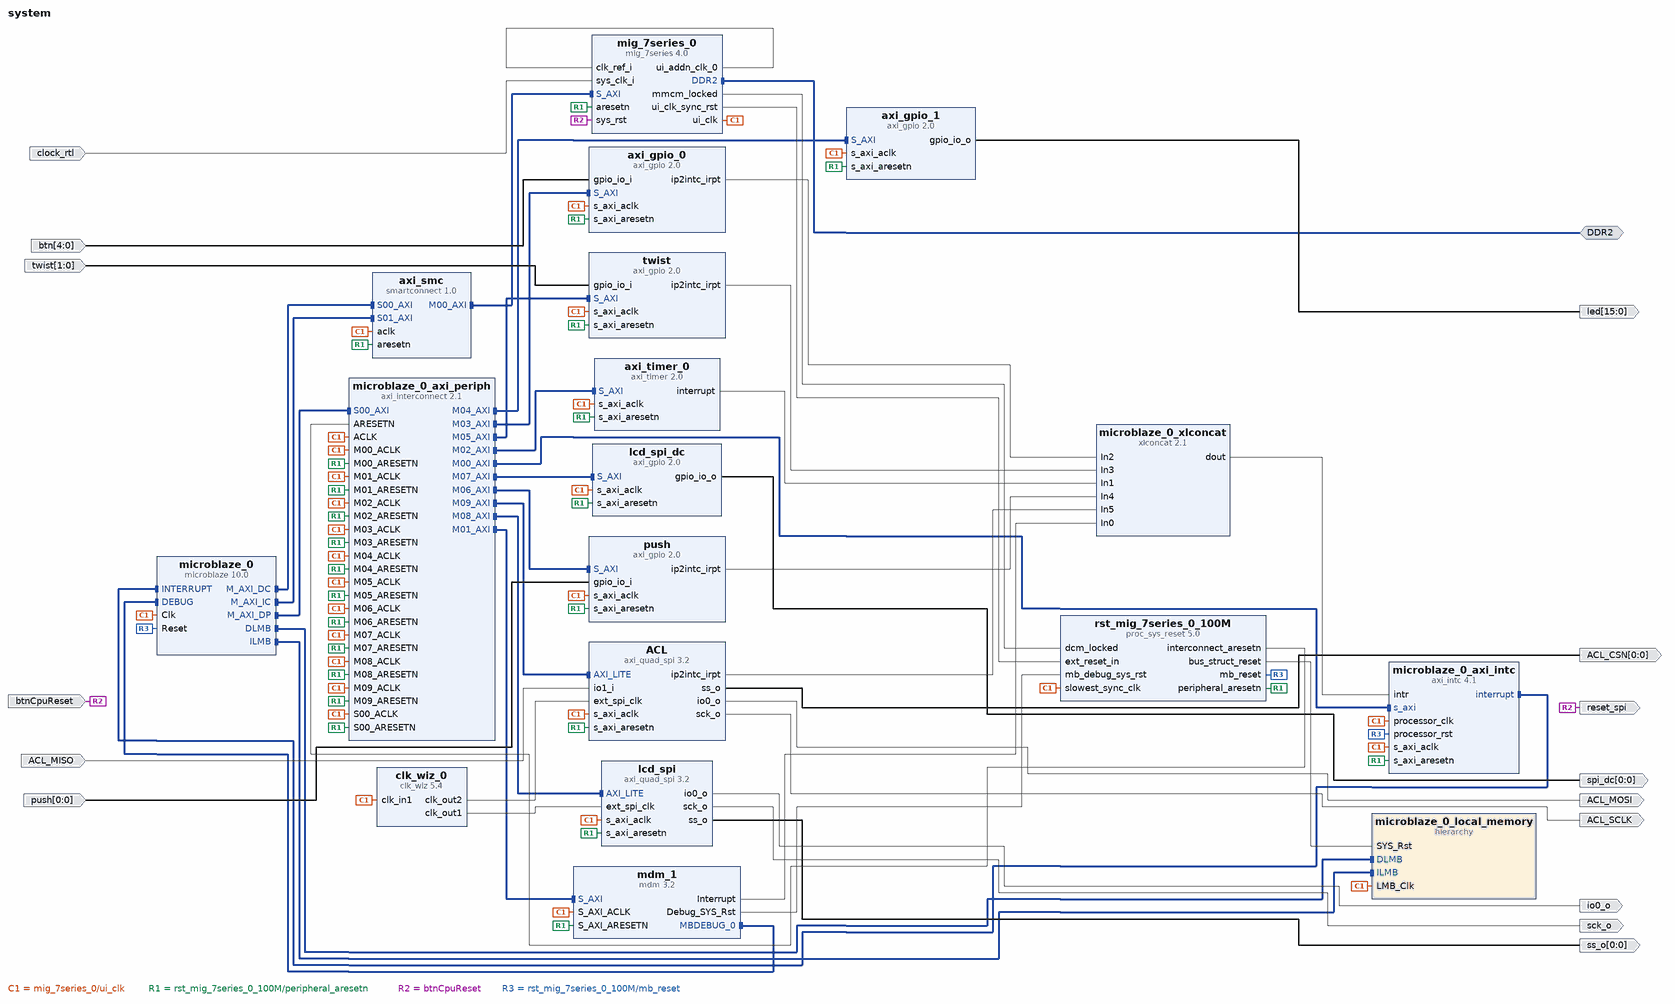
[diagram p0: block diagram of the top level]
# Vivado block design system, xc7a100tcsg324-1, Vivado 2017.2
create_bd_design system

create_bd_intf_port -mode Master -vlnv xilinx.com:interface:ddrx_rtl:1.0 DDR2
create_bd_port -dir I -type clk clock_rtl
set_property -dict {CONFIG.CLK_DOMAIN clock_rtl} [get_bd_ports clock_rtl]
create_bd_port -dir I -type rst btnCpuReset
create_bd_port -dir O reset_spi
create_bd_port -dir I -from 4 -to 0 btn
create_bd_port -dir O -from 15 -to 0 led
create_bd_port -dir I -from 1 -to 0 twist
create_bd_port -dir I -from 0 -to 0 push
create_bd_port -dir O -from 0 -to 0 spi_dc
create_bd_port -dir O io0_o
create_bd_port -dir O sck_o
create_bd_port -dir O -from 0 -to 0 ss_o
create_bd_port -dir I ACL_MISO
create_bd_port -dir O ACL_SCLK
create_bd_port -dir O -from 0 -to 0 ACL_CSN
create_bd_port -dir O ACL_MOSI

create_bd_cell -type ip -vlnv xilinx.com:ip:microblaze:10.0 microblaze_0
set_property -dict [list \
  CONFIG.C_D_AXI 1 \
  CONFIG.C_D_LMB 1 \
  CONFIG.C_I_LMB 1 \
  CONFIG.C_USE_MSR_INSTR 1 \
  CONFIG.C_USE_PCMP_INSTR 1 \
  CONFIG.C_USE_BARREL 1 \
  CONFIG.C_USE_DIV 1 \
  CONFIG.C_USE_HW_MUL 2 \
  CONFIG.C_USE_FPU 1 \
  CONFIG.C_DEBUG_ENABLED 1 \
  CONFIG.C_USE_ICACHE 1 \
  CONFIG.C_CACHE_BYTE_SIZE 65536 \
  CONFIG.C_USE_DCACHE 1 \
  CONFIG.C_DCACHE_BYTE_SIZE 65536 \
  CONFIG.C_USE_BRANCH_TARGET_CACHE 1 \
  CONFIG.C_BRANCH_TARGET_CACHE_SIZE 5 \
] [get_bd_cells microblaze_0]
create_bd_cell -type hier microblaze_0_local_memory
create_bd_cell -type ip -vlnv xilinx.com:ip:axi_interconnect:2.1 microblaze_0_axi_periph
set_property -dict {CONFIG.NUM_MI 10} [get_bd_cells microblaze_0_axi_periph]
create_bd_cell -type ip -vlnv xilinx.com:ip:axi_intc:4.1 microblaze_0_axi_intc
set_property -dict {CONFIG.C_HAS_FAST 1} [get_bd_cells microblaze_0_axi_intc]
create_bd_cell -type ip -vlnv xilinx.com:ip:xlconcat:2.1 microblaze_0_xlconcat
set_property -dict {CONFIG.NUM_PORTS 6} [get_bd_cells microblaze_0_xlconcat]
create_bd_cell -type ip -vlnv xilinx.com:ip:mdm:3.2 mdm_1
set_property -dict {CONFIG.C_USE_UART 1} [get_bd_cells mdm_1]
create_bd_cell -type ip -vlnv xilinx.com:ip:mig_7series:4.0 mig_7series_0
set_property -dict [list \
  CONFIG.XML_INPUT_FILE mig_b.prj \
  CONFIG.RESET_BOARD_INTERFACE Custom \
  CONFIG.MIG_DONT_TOUCH_PARAM Custom \
  CONFIG.BOARD_MIG_PARAM Custom \
] [get_bd_cells mig_7series_0]
create_bd_cell -type ip -vlnv xilinx.com:ip:smartconnect:1.0 axi_smc
set_property -dict {CONFIG.NUM_SI 2} [get_bd_cells axi_smc]
create_bd_cell -type ip -vlnv xilinx.com:ip:proc_sys_reset:5.0 rst_mig_7series_0_100M
create_bd_cell -type ip -vlnv xilinx.com:ip:axi_timer:2.0 axi_timer_0
create_bd_cell -type ip -vlnv xilinx.com:ip:axi_gpio:2.0 axi_gpio_0
set_property -dict {CONFIG.C_GPIO_WIDTH 5 CONFIG.C_ALL_INPUTS 1 CONFIG.C_INTERRUPT_PRESENT 1} [get_bd_cells axi_gpio_0]
create_bd_cell -type ip -vlnv xilinx.com:ip:axi_gpio:2.0 axi_gpio_1
set_property -dict {CONFIG.C_GPIO_WIDTH 16 CONFIG.C_ALL_OUTPUTS 1} [get_bd_cells axi_gpio_1]
create_bd_cell -type ip -vlnv xilinx.com:ip:axi_gpio:2.0 twist
set_property -dict {CONFIG.C_GPIO_WIDTH 2 CONFIG.C_ALL_INPUTS 1 CONFIG.C_INTERRUPT_PRESENT 1} [get_bd_cells twist]
create_bd_cell -type ip -vlnv xilinx.com:ip:axi_gpio:2.0 push
set_property -dict {CONFIG.C_GPIO_WIDTH 1 CONFIG.C_ALL_INPUTS 1 CONFIG.C_INTERRUPT_PRESENT 1} [get_bd_cells push]
create_bd_cell -type ip -vlnv xilinx.com:ip:axi_gpio:2.0 lcd_spi_dc
set_property -dict {CONFIG.C_GPIO_WIDTH 1 CONFIG.C_ALL_OUTPUTS 1} [get_bd_cells lcd_spi_dc]
create_bd_cell -type ip -vlnv xilinx.com:ip:clk_wiz:5.4 clk_wiz_0
set_property -dict [list \
  CONFIG.CLKOUT2_USED true \
  CONFIG.NUM_OUT_CLKS 2 \
  CONFIG.CLKOUT1_REQUESTED_OUT_FREQ 20.000 \
  CONFIG.CLKOUT2_REQUESTED_OUT_FREQ 10.000 \
  CONFIG.USE_LOCKED false \
  CONFIG.USE_RESET false \
  CONFIG.MMCM_DIVCLK_DIVIDE 1 \
  CONFIG.MMCM_CLKFBOUT_MULT_F 10.000 \
  CONFIG.MMCM_CLKOUT0_DIVIDE_F 50.000 \
  CONFIG.MMCM_CLKOUT1_DIVIDE 100 \
  CONFIG.CLKOUT1_JITTER 183.243 \
  CONFIG.CLKOUT1_PHASE_ERROR 98.575 \
  CONFIG.CLKOUT2_JITTER 209.588 \
  CONFIG.CLKOUT2_PHASE_ERROR 98.575 \
] [get_bd_cells clk_wiz_0]
create_bd_cell -type ip -vlnv xilinx.com:ip:axi_quad_spi:3.2 lcd_spi
set_property -dict {CONFIG.C_USE_STARTUP 0 CONFIG.C_SCK_RATIO 2 CONFIG.C_FIFO_DEPTH 256} [get_bd_cells lcd_spi]
create_bd_cell -type ip -vlnv xilinx.com:ip:axi_quad_spi:3.2 ACL
set_property -dict [list \
  CONFIG.C_USE_STARTUP 0 \
  CONFIG.C_SCK_RATIO 2 \
  CONFIG.C_FIFO_DEPTH 256 \
  CONFIG.C_XIP_MODE 0 \
  CONFIG.C_TYPE_OF_AXI4_INTERFACE 0 \
] [get_bd_cells ACL]

# ---- hierarchy /microblaze_0_local_memory ----
current_bd_instance /microblaze_0_local_memory
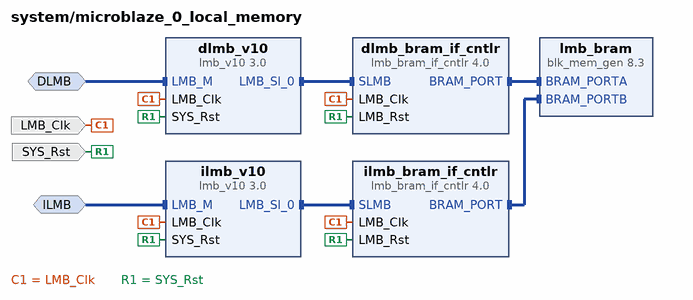
[diagram p1: block diagram inside /microblaze_0_local_memory]
create_bd_intf_pin -mode MirroredMaster -vlnv xilinx.com:interface:lmb_rtl:1.0 DLMB
create_bd_intf_pin -mode MirroredMaster -vlnv xilinx.com:interface:lmb_rtl:1.0 ILMB
create_bd_pin -dir I -type clk LMB_Clk
create_bd_pin -dir I SYS_Rst

create_bd_cell -type ip -vlnv xilinx.com:ip:lmb_v10:3.0 dlmb_v10
create_bd_cell -type ip -vlnv xilinx.com:ip:lmb_v10:3.0 ilmb_v10
create_bd_cell -type ip -vlnv xilinx.com:ip:lmb_bram_if_cntlr:4.0 dlmb_bram_if_cntlr
set_property -dict {CONFIG.C_ECC 0} [get_bd_cells dlmb_bram_if_cntlr]
create_bd_cell -type ip -vlnv xilinx.com:ip:lmb_bram_if_cntlr:4.0 ilmb_bram_if_cntlr
set_property -dict {CONFIG.C_ECC 0} [get_bd_cells ilmb_bram_if_cntlr]
create_bd_cell -type ip -vlnv xilinx.com:ip:blk_mem_gen:8.3 lmb_bram
set_property -dict {CONFIG.Memory_Type True_Dual_Port_RAM CONFIG.use_bram_block BRAM_Controller} [get_bd_cells lmb_bram]

# ---- connections ----

current_bd_instance /microblaze_0_local_memory
connect_bd_intf_net -intf_net microblaze_0_dlmb_bus [get_bd_intf_pins dlmb_v10/LMB_Sl_0] [get_bd_intf_pins dlmb_bram_if_cntlr/SLMB]
connect_bd_intf_net -intf_net microblaze_0_ilmb_bus [get_bd_intf_pins ilmb_v10/LMB_Sl_0] [get_bd_intf_pins ilmb_bram_if_cntlr/SLMB]
connect_bd_intf_net -intf_net microblaze_0_dlmb_cntlr [get_bd_intf_pins dlmb_bram_if_cntlr/BRAM_PORT] [get_bd_intf_pins lmb_bram/BRAM_PORTA]
connect_bd_intf_net -intf_net microblaze_0_ilmb_cntlr [get_bd_intf_pins ilmb_bram_if_cntlr/BRAM_PORT] [get_bd_intf_pins lmb_bram/BRAM_PORTB]
connect_bd_intf_net -intf_net microblaze_0_dlmb [get_bd_intf_pins DLMB] [get_bd_intf_pins dlmb_v10/LMB_M]
connect_bd_intf_net -intf_net microblaze_0_ilmb [get_bd_intf_pins ILMB] [get_bd_intf_pins ilmb_v10/LMB_M]
connect_bd_net -net microblaze_0_Clk [get_bd_pins LMB_Clk] \
  [get_bd_pins dlmb_v10/LMB_Clk] [get_bd_pins dlmb_bram_if_cntlr/LMB_Clk] [get_bd_pins ilmb_v10/LMB_Clk] \
  [get_bd_pins ilmb_bram_if_cntlr/LMB_Clk]
connect_bd_net -net microblaze_0_LMB_Rst [get_bd_pins SYS_Rst] \
  [get_bd_pins dlmb_v10/SYS_Rst] [get_bd_pins dlmb_bram_if_cntlr/LMB_Rst] [get_bd_pins ilmb_v10/SYS_Rst] \
  [get_bd_pins ilmb_bram_if_cntlr/LMB_Rst]

current_bd_instance /
connect_bd_intf_net [get_bd_intf_pins microblaze_0/DLMB] [get_bd_intf_pins microblaze_0_local_memory/DLMB]
connect_bd_intf_net [get_bd_intf_pins microblaze_0/ILMB] [get_bd_intf_pins microblaze_0_local_memory/ILMB]
connect_bd_intf_net -intf_net microblaze_0_axi_dp [get_bd_intf_pins microblaze_0_axi_periph/S00_AXI] [get_bd_intf_pins microblaze_0/M_AXI_DP]
connect_bd_intf_net [get_bd_intf_pins microblaze_0_axi_intc/interrupt] [get_bd_intf_pins microblaze_0/INTERRUPT]
connect_bd_intf_net -intf_net microblaze_0_intc_axi [get_bd_intf_pins microblaze_0_axi_periph/M00_AXI] [get_bd_intf_pins microblaze_0_axi_intc/s_axi]
connect_bd_intf_net [get_bd_intf_pins mdm_1/MBDEBUG_0] [get_bd_intf_pins microblaze_0/DEBUG]
connect_bd_intf_net -intf_net microblaze_0_mdm_axi [get_bd_intf_pins microblaze_0_axi_periph/M01_AXI] [get_bd_intf_pins mdm_1/S_AXI]
connect_bd_intf_net [get_bd_intf_pins microblaze_0/M_AXI_DC] [get_bd_intf_pins axi_smc/S00_AXI]
connect_bd_intf_net [get_bd_intf_pins axi_smc/M00_AXI] [get_bd_intf_pins mig_7series_0/S_AXI]
connect_bd_intf_net [get_bd_intf_pins microblaze_0/M_AXI_IC] [get_bd_intf_pins axi_smc/S01_AXI]
connect_bd_intf_net [get_bd_intf_pins microblaze_0_axi_periph/M02_AXI] [get_bd_intf_pins axi_timer_0/S_AXI]
connect_bd_intf_net [get_bd_intf_pins microblaze_0_axi_periph/M03_AXI] [get_bd_intf_pins axi_gpio_0/S_AXI]
connect_bd_intf_net [get_bd_intf_pins microblaze_0_axi_periph/M04_AXI] [get_bd_intf_pins axi_gpio_1/S_AXI]
connect_bd_intf_net [get_bd_intf_pins microblaze_0_axi_periph/M05_AXI] [get_bd_intf_pins twist/S_AXI]
connect_bd_intf_net [get_bd_intf_pins microblaze_0_axi_periph/M06_AXI] [get_bd_intf_pins push/S_AXI]
connect_bd_intf_net [get_bd_intf_pins microblaze_0_axi_periph/M07_AXI] [get_bd_intf_pins lcd_spi_dc/S_AXI]
connect_bd_intf_net [get_bd_intf_pins microblaze_0_axi_periph/M08_AXI] [get_bd_intf_pins lcd_spi/AXI_LITE]
connect_bd_intf_net [get_bd_intf_pins microblaze_0_axi_periph/M09_AXI] [get_bd_intf_pins ACL/AXI_LITE]
connect_bd_intf_net [get_bd_intf_ports DDR2] [get_bd_intf_pins mig_7series_0/DDR2]
connect_bd_net -net microblaze_0_intr [get_bd_pins microblaze_0_xlconcat/dout] [get_bd_pins microblaze_0_axi_intc/intr]
connect_bd_net -net microblaze_0_Clk [get_bd_pins mig_7series_0/ui_clk] \
  [get_bd_pins microblaze_0/Clk] [get_bd_pins microblaze_0_axi_intc/s_axi_aclk] \
  [get_bd_pins microblaze_0_axi_intc/processor_clk] [get_bd_pins mdm_1/S_AXI_ACLK] [get_bd_pins axi_smc/aclk] \
  [get_bd_pins rst_mig_7series_0_100M/slowest_sync_clk] [get_bd_pins axi_timer_0/s_axi_aclk] \
  [get_bd_pins axi_gpio_0/s_axi_aclk] [get_bd_pins axi_gpio_1/s_axi_aclk] [get_bd_pins twist/s_axi_aclk] \
  [get_bd_pins push/s_axi_aclk] [get_bd_pins lcd_spi_dc/s_axi_aclk] [get_bd_pins clk_wiz_0/clk_in1] \
  [get_bd_pins lcd_spi/s_axi_aclk] [get_bd_pins ACL/s_axi_aclk] [get_bd_pins microblaze_0_axi_periph/ACLK] \
  [get_bd_pins microblaze_0_axi_periph/S00_ACLK] [get_bd_pins microblaze_0_axi_periph/M00_ACLK] \
  [get_bd_pins microblaze_0_axi_periph/M01_ACLK] [get_bd_pins microblaze_0_local_memory/LMB_Clk] \
  [get_bd_pins microblaze_0_axi_periph/M02_ACLK] [get_bd_pins microblaze_0_axi_periph/M03_ACLK] \
  [get_bd_pins microblaze_0_axi_periph/M04_ACLK] [get_bd_pins microblaze_0_axi_periph/M05_ACLK] \
  [get_bd_pins microblaze_0_axi_periph/M06_ACLK] [get_bd_pins microblaze_0_axi_periph/M07_ACLK] \
  [get_bd_pins microblaze_0_axi_periph/M08_ACLK] [get_bd_pins microblaze_0_axi_periph/M09_ACLK]
connect_bd_net [get_bd_pins mig_7series_0/mmcm_locked] [get_bd_pins rst_mig_7series_0_100M/dcm_locked]
connect_bd_net [get_bd_pins rst_mig_7series_0_100M/peripheral_aresetn] \
  [get_bd_pins mig_7series_0/aresetn] [get_bd_pins axi_smc/aresetn] [get_bd_pins axi_timer_0/s_axi_aresetn] \
  [get_bd_pins axi_gpio_0/s_axi_aresetn] [get_bd_pins axi_gpio_1/s_axi_aresetn] [get_bd_pins mdm_1/S_AXI_ARESETN] \
  [get_bd_pins microblaze_0_axi_intc/s_axi_aresetn] [get_bd_pins twist/s_axi_aresetn] [get_bd_pins push/s_axi_aresetn] \
  [get_bd_pins lcd_spi_dc/s_axi_aresetn] [get_bd_pins lcd_spi/s_axi_aresetn] [get_bd_pins ACL/s_axi_aresetn] \
  [get_bd_pins microblaze_0_axi_periph/S00_ARESETN] [get_bd_pins microblaze_0_axi_periph/M02_ARESETN] \
  [get_bd_pins microblaze_0_axi_periph/M03_ARESETN] [get_bd_pins microblaze_0_axi_periph/M04_ARESETN] \
  [get_bd_pins microblaze_0_axi_periph/M00_ARESETN] [get_bd_pins microblaze_0_axi_periph/M01_ARESETN] \
  [get_bd_pins microblaze_0_axi_periph/M05_ARESETN] [get_bd_pins microblaze_0_axi_periph/M06_ARESETN] \
  [get_bd_pins microblaze_0_axi_periph/M07_ARESETN] [get_bd_pins microblaze_0_axi_periph/M08_ARESETN] \
  [get_bd_pins microblaze_0_axi_periph/M09_ARESETN]
connect_bd_net [get_bd_ports clock_rtl] [get_bd_pins mig_7series_0/sys_clk_i]
connect_bd_net [get_bd_pins mdm_1/Interrupt] [get_bd_pins microblaze_0_xlconcat/In0]
connect_bd_net -net sys_rst_1 [get_bd_ports btnCpuReset] [get_bd_ports reset_spi] [get_bd_pins mig_7series_0/sys_rst]
connect_bd_net [get_bd_pins mig_7series_0/ui_addn_clk_0] [get_bd_pins mig_7series_0/clk_ref_i]
connect_bd_net [get_bd_pins rst_mig_7series_0_100M/interconnect_aresetn] [get_bd_pins microblaze_0_axi_periph/ARESETN]
connect_bd_net [get_bd_pins axi_timer_0/interrupt] [get_bd_pins microblaze_0_xlconcat/In1]
connect_bd_net [get_bd_pins mig_7series_0/ui_clk_sync_rst] [get_bd_pins rst_mig_7series_0_100M/ext_reset_in]
connect_bd_net [get_bd_pins rst_mig_7series_0_100M/mb_reset] [get_bd_pins microblaze_0/Reset] [get_bd_pins microblaze_0_axi_intc/processor_rst]
connect_bd_net [get_bd_pins mdm_1/Debug_SYS_Rst] [get_bd_pins rst_mig_7series_0_100M/mb_debug_sys_rst]
connect_bd_net [get_bd_pins rst_mig_7series_0_100M/bus_struct_reset] [get_bd_pins microblaze_0_local_memory/SYS_Rst]
connect_bd_net -net gpio_io_i_1 [get_bd_ports btn] [get_bd_pins axi_gpio_0/gpio_io_i]
connect_bd_net [get_bd_pins axi_gpio_1/gpio_io_o] [get_bd_ports led]
connect_bd_net [get_bd_pins axi_gpio_0/ip2intc_irpt] [get_bd_pins microblaze_0_xlconcat/In2]
connect_bd_net [get_bd_pins twist/ip2intc_irpt] [get_bd_pins microblaze_0_xlconcat/In3]
connect_bd_net [get_bd_pins push/ip2intc_irpt] [get_bd_pins microblaze_0_xlconcat/In4]
connect_bd_net -net gpio_io_i_2 [get_bd_ports twist] [get_bd_pins twist/gpio_io_i]
connect_bd_net -net gpio_io_i_3 [get_bd_ports push] [get_bd_pins push/gpio_io_i]
connect_bd_net -net spi_dc_gpio_io_o [get_bd_pins lcd_spi_dc/gpio_io_o] [get_bd_ports spi_dc]
connect_bd_net [get_bd_pins clk_wiz_0/clk_out1] [get_bd_pins lcd_spi/ext_spi_clk]
connect_bd_net -net spi_io0_o [get_bd_pins lcd_spi/io0_o] [get_bd_ports io0_o]
connect_bd_net -net spi_sck_o [get_bd_pins lcd_spi/sck_o] [get_bd_ports sck_o]
connect_bd_net -net spi_ss_o [get_bd_pins lcd_spi/ss_o] [get_bd_ports ss_o]
connect_bd_net [get_bd_pins clk_wiz_0/clk_out2] [get_bd_pins ACL/ext_spi_clk]
connect_bd_net -net axi_quad_spi_0_ip2intc_irpt [get_bd_pins ACL/ip2intc_irpt] [get_bd_pins microblaze_0_xlconcat/In5]
connect_bd_net -net acl_spi_sck_o [get_bd_pins ACL/sck_o] [get_bd_ports ACL_SCLK]
connect_bd_net -net acl_spi_ss_o [get_bd_pins ACL/ss_o] [get_bd_ports ACL_CSN]
connect_bd_net [get_bd_pins ACL/io0_o] [get_bd_ports ACL_MOSI]
connect_bd_net [get_bd_ports ACL_MISO] [get_bd_pins ACL/io1_i]

# ---- address map ----
assign_bd_address -offset 0x00000000 -range 64K -target_address_space [get_bd_addr_spaces microblaze_0/Data] [get_bd_addr_segs microblaze_0_local_memory/dlmb_bram_if_cntlr/SLMB/Mem]
assign_bd_address -offset 0x40000000 -range 64K -target_address_space [get_bd_addr_spaces microblaze_0/Data] [get_bd_addr_segs axi_gpio_0/S_AXI/Reg]
assign_bd_address -offset 0x40010000 -range 64K -target_address_space [get_bd_addr_spaces microblaze_0/Data] [get_bd_addr_segs axi_gpio_1/S_AXI/Reg]
assign_bd_address -offset 0x40020000 -range 64K -target_address_space [get_bd_addr_spaces microblaze_0/Data] [get_bd_addr_segs twist/S_AXI/Reg]
assign_bd_address -offset 0x40030000 -range 64K -target_address_space [get_bd_addr_spaces microblaze_0/Data] [get_bd_addr_segs push/S_AXI/Reg]
assign_bd_address -offset 0x40040000 -range 64K -target_address_space [get_bd_addr_spaces microblaze_0/Data] [get_bd_addr_segs lcd_spi_dc/S_AXI/Reg]
assign_bd_address -offset 0x41200000 -range 64K -target_address_space [get_bd_addr_spaces microblaze_0/Data] [get_bd_addr_segs microblaze_0_axi_intc/S_AXI/Reg]
assign_bd_address -offset 0x41400000 -range 4K -target_address_space [get_bd_addr_spaces microblaze_0/Data] [get_bd_addr_segs mdm_1/S_AXI/Reg]
assign_bd_address -offset 0x41C00000 -range 64K -target_address_space [get_bd_addr_spaces microblaze_0/Data] [get_bd_addr_segs axi_timer_0/S_AXI/Reg]
assign_bd_address -offset 0x44A00000 -range 64K -target_address_space [get_bd_addr_spaces microblaze_0/Data] [get_bd_addr_segs lcd_spi/AXI_LITE/Reg]
assign_bd_address -offset 0x44A10000 -range 64K -target_address_space [get_bd_addr_spaces microblaze_0/Data] [get_bd_addr_segs ACL/AXI_LITE/Reg]
assign_bd_address -offset 0x80000000 -range 128M -target_address_space [get_bd_addr_spaces microblaze_0/Data] [get_bd_addr_segs mig_7series_0/memmap/memaddr]
assign_bd_address -offset 0x00000000 -range 64K -target_address_space [get_bd_addr_spaces microblaze_0/Instruction] [get_bd_addr_segs microblaze_0_local_memory/ilmb_bram_if_cntlr/SLMB/Mem]
assign_bd_address -offset 0x80000000 -range 128M -target_address_space [get_bd_addr_spaces microblaze_0/Instruction] [get_bd_addr_segs mig_7series_0/memmap/memaddr]

validate_bd_design
save_bd_design
